# EasyEDA schematic kezpad_SCH.json
TITLE: Sheet_1; REV: 1.0; Date: 2025-05-22; Sheet: 1/1; Drawn By: kez9; Company: Your Company
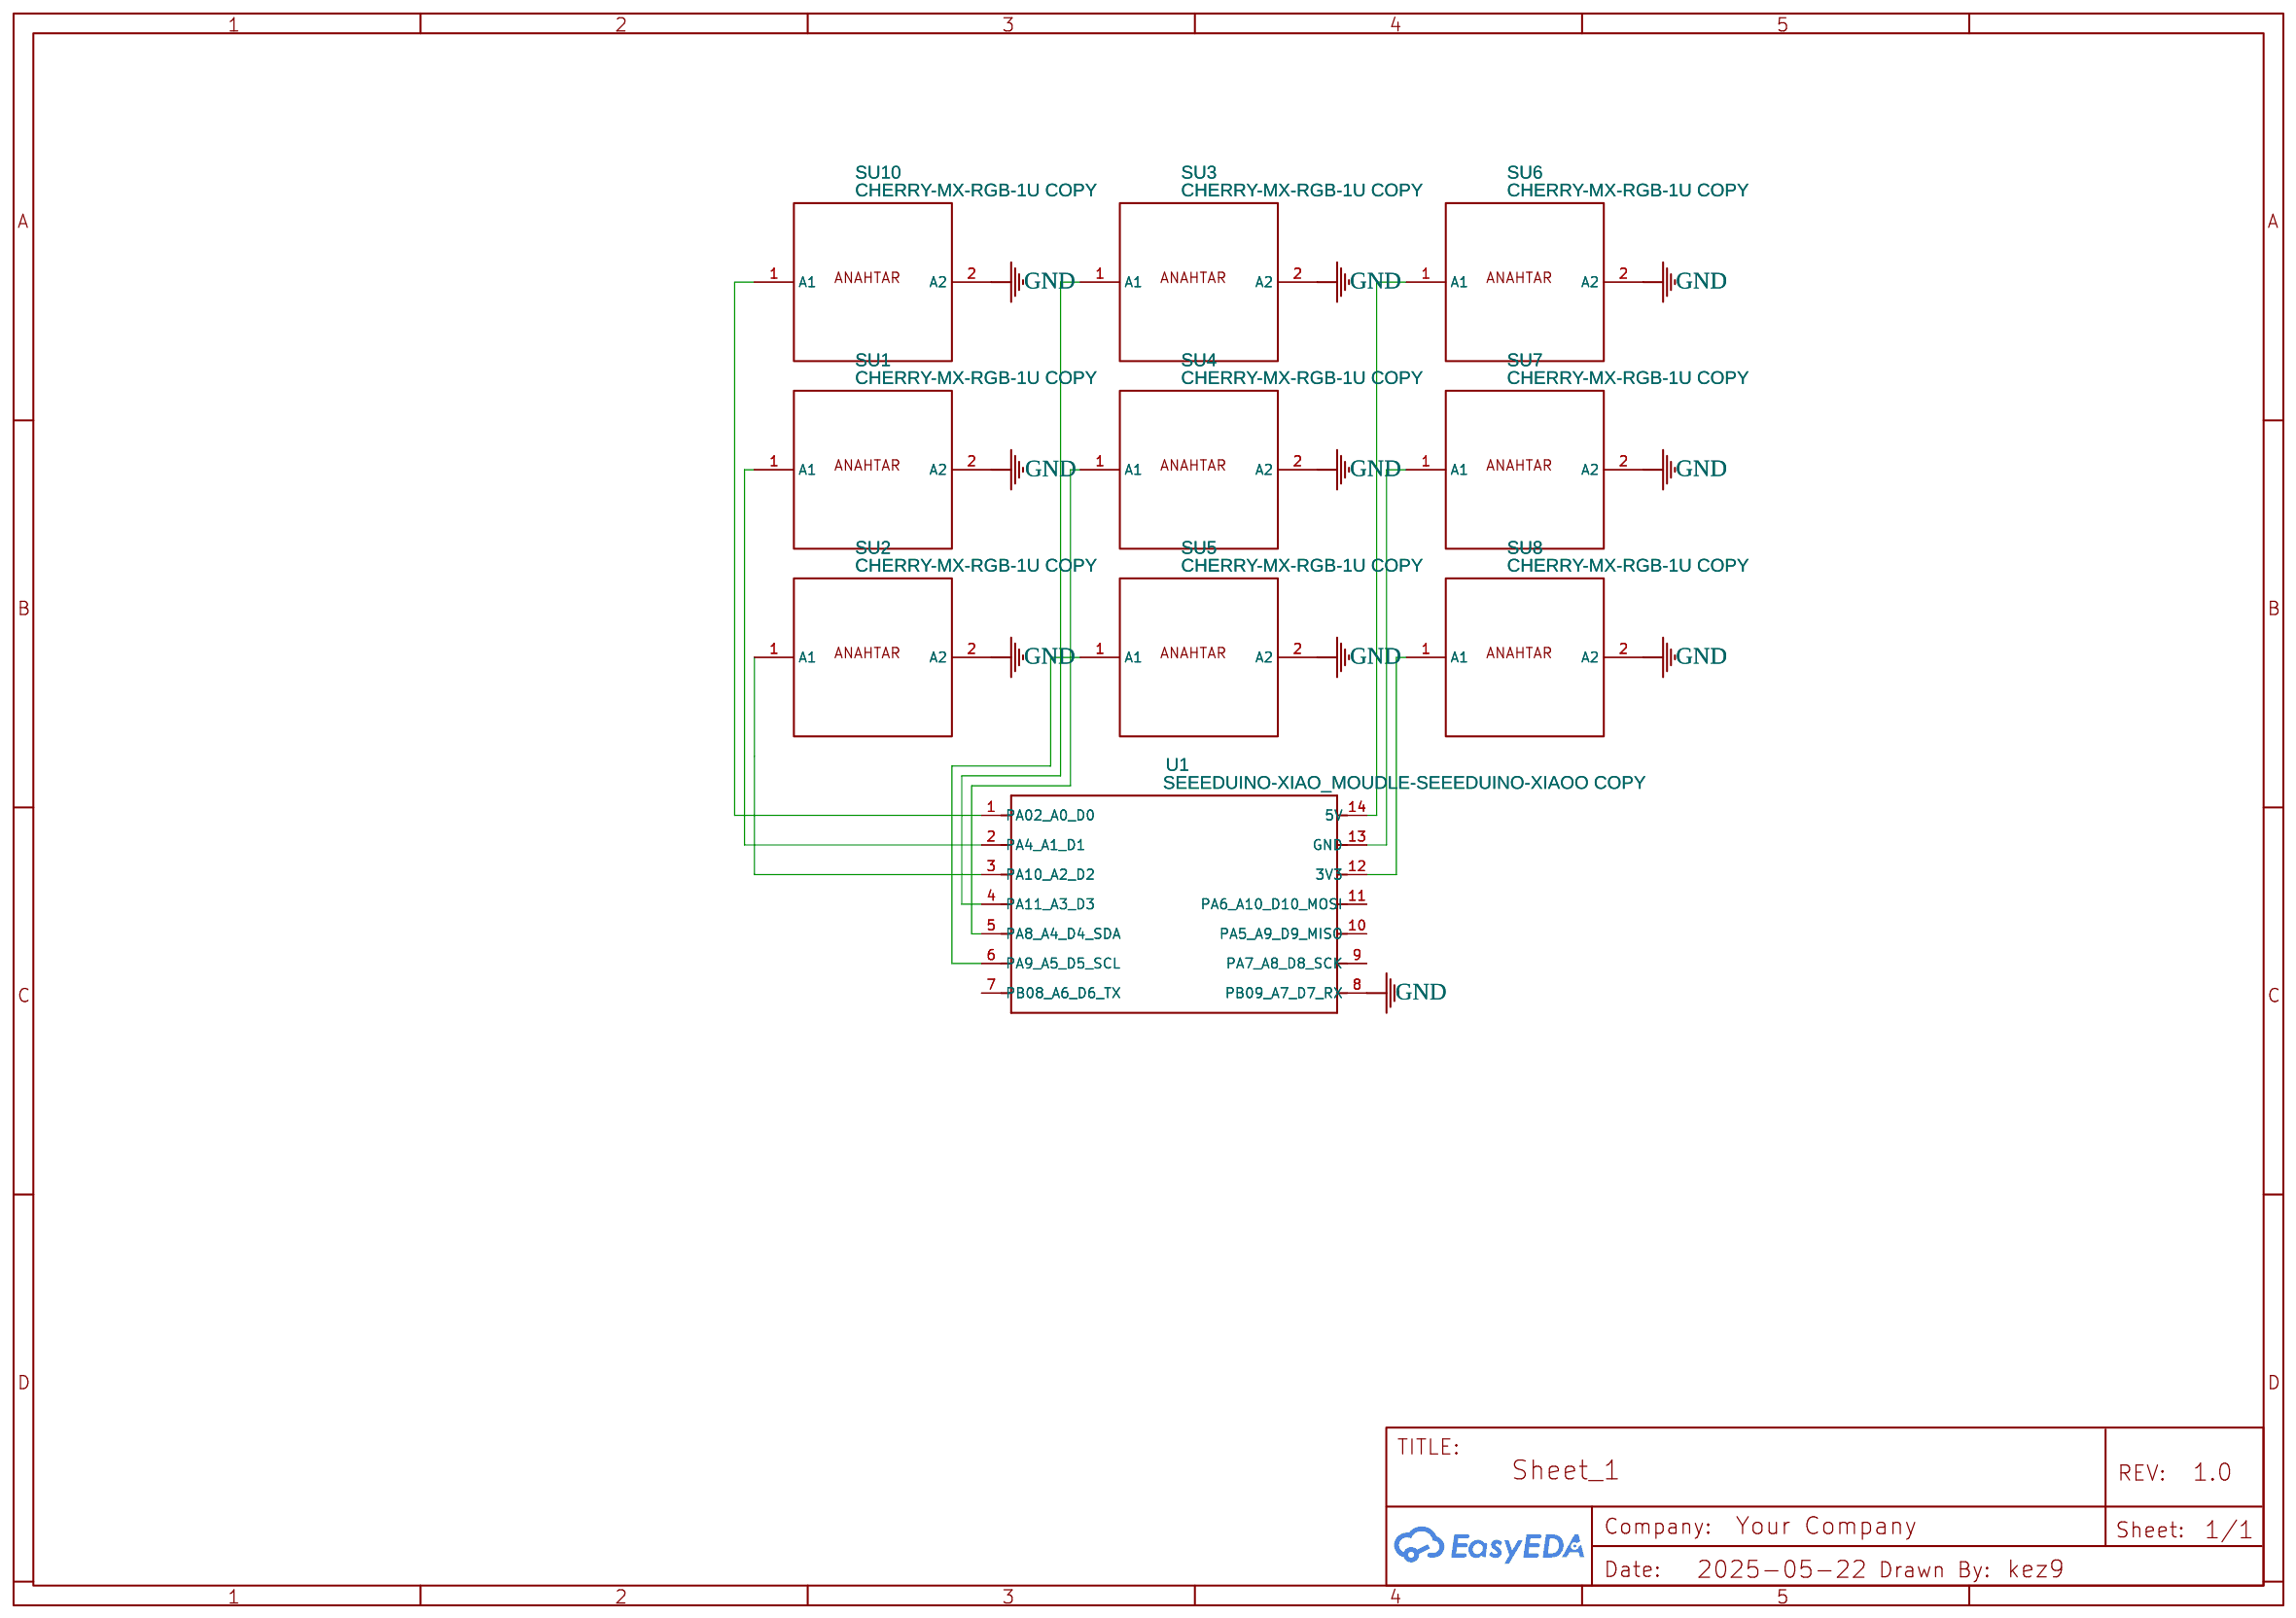
[diagram p0: schematic sheet]

## Parts
SU1  CHERRY-MX-RGB-1U COPY  [EDITRED FOORPTINT]
SU2  CHERRY-MX-RGB-1U COPY  [EDITRED FOORPTINT]
SU3  CHERRY-MX-RGB-1U COPY  [EDITRED FOORPTINT]
SU4  CHERRY-MX-RGB-1U COPY  [EDITRED FOORPTINT]
SU5  CHERRY-MX-RGB-1U COPY  [EDITRED FOORPTINT]
SU6  CHERRY-MX-RGB-1U COPY  [EDITRED FOORPTINT]
SU7  CHERRY-MX-RGB-1U COPY  [EDITRED FOORPTINT]
SU8  CHERRY-MX-RGB-1U COPY  [EDITRED FOORPTINT]
SU10  CHERRY-MX-RGB-1U COPY  [EDITRED FOORPTINT]
U1  SEEEDUINO-XIAO_MOUDLE-SEEEDUINO-XIAOO COPY  [SEEEDUINO-XIAO_XIAO_LGPIN]

## Library data of the parts
SU1-SU8 SU10 = CHERRY-MX-RGB-1U COPY: Contributor: kez9
U1 = SEEEDUINO-XIAO_MOUDLE-SEEEDUINO-XIAOO COPY: Contributor: naranavi

## Nets
GND: SU1.2(A2) SU2.2(A2) SU3.2(A2) SU4.2(A2) SU5.2(A2) SU6.2(A2) SU7.2(A2) SU8.2(A2) SU10.2(A2) U1.8(PB09_A7_D7_RX)
Net-(SU1-1): SU1.1(A1) U1.2(PA4_A1_D1)
Net-(SU2-1): SU2.1(A1) U1.3(PA10_A2_D2)
Net-(SU3-1): SU3.1(A1) U1.4(PA11_A3_D3)
Net-(SU4-1): SU4.1(A1) U1.5(PA8_A4_D4_SDA)
Net-(SU5-1): SU5.1(A1) U1.6(PA9_A5_D5_SCL)
Net-(SU6-1): SU6.1(A1) U1.14(5V)
Net-(SU7-1): SU7.1(A1) U1.13(GND)
Net-(SU8-1): SU8.1(A1) U1.12(3V3)
Net-(SU10-1): SU10.1(A1) U1.1(PA02_A0_D0)

Not connected (* = marked no-connect by the designer): U1 7(PB08_A6_D6_TX) 9(PA7_A8_D8_SCK) 10(PA5_A9_D9_MISO) 11(PA6_A10_D10_MOSI)
